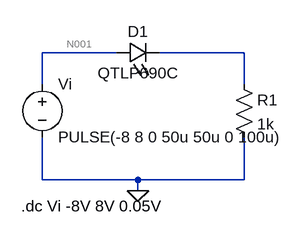
[diagram p0: schematic dcSweep.asc]
dcSweep.asc, the LTspice schematic file:
Version 4
SHEET 1 880 680
WIRE 160 96 48 96
WIRE 352 96 224 96
WIRE 48 144 48 96
WIRE 352 144 352 96
WIRE 48 288 48 224
WIRE 192 288 48 288
WIRE 352 288 352 224
WIRE 352 288 192 288
WIRE 192 304 192 288
FLAG 192 304 0
SYMBOL res 336 128 R0
SYMATTR InstName R1
SYMATTR Value 1k
SYMBOL LED 160 112 R270
WINDOW 0 32 32 VTop 2
WINDOW 3 0 32 VBottom 2
SYMATTR InstName D1
SYMATTR Value QTLP690C
SYMATTR Description Diode
SYMATTR Type diode
SYMBOL voltage 48 128 R0
WINDOW 123 0 0 Left 0
WINDOW 39 0 0 Left 0
SYMATTR InstName Vi
SYMATTR Value PULSE(-8 8 0 50u 50u 0 100u)
TEXT 16 328 Left 2 !.dc Vi -8V 8V 0.05V

The netlist it stands for:
* dcSweep.asc
R1 N002 0 1k
D1 N001 N002 QTLP690C
Vi N001 0 PULSE(-8 8 0 50u 50u 0 100u)
.model D D
.lib standard.dio
.dc Vi -8V 8V 0.05V
.backanno
.end

* Results of the author's LTspice run, read from the files saved beside the schematic
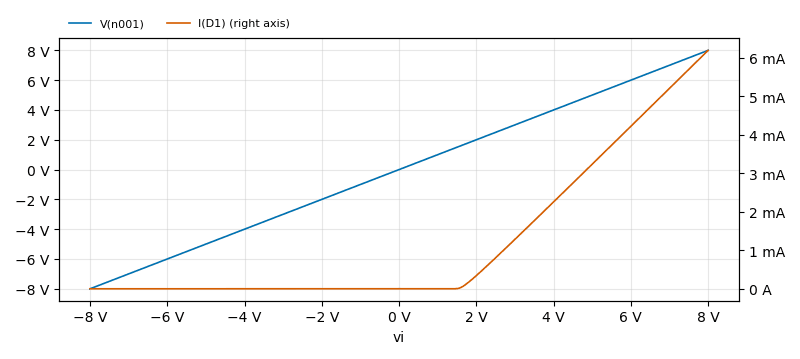
[diagram p1: DC transfer characteristic of dcSweep.asc, plotted from the saved traces]
* DC transfer characteristic, 1 run:
*   V(n001): -8 V at vi=-8 V, 8 V at vi=8 V, min -8 V, max 8 V
*   I(D1): -8 pA at vi=-8 V, 6.195 mA at vi=8 V, min -8 pA, max 6.195 mA